# Altium schematic sheet 100-677-01-00 BCB.SchDoc: Battery Control Board (part 3 of 3)
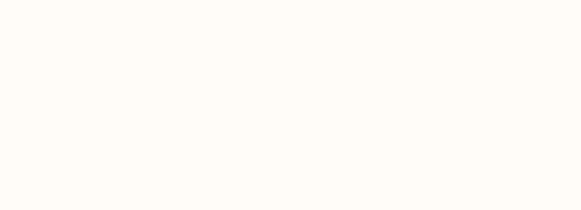
[diagram p7: 100-677-01-00 BCB.SchDoc, bottom right]

## Library data of the parts (continued)
R88 = Res 10M 1206: RES 10.0M OHM 1/4W 1% 1206 SMD; Manufacturer 1: Vishay Dale; Manufacturer Part Number 1: CRCW120610M0FKEA; Power (Watts): 0.25W, 1/4W; Temperature Coefficient: ±100ppm/°C; Category 1: Resistors; Supplier 1: Digi-Key; Supplier Part Number 1: 541-10.0MFTR-ND; Stock 1: 40000; Pricing 1: 5000=0.0102, 10000=0.00918, 25000=0.00816, 50000=0.0068, 100000=0.00564, 250000=0.0051, 500000=0.00459 (USD); Resistance (Ohms): 10M; Composition: Thick Film; Features: Automotive AEC-Q200 Qualified; Tolerance: ±1%; Package / Case: 1206 (3216 Metric); Supplier Device Package: 1206 (3216 Metric); Size / Dimension: 0.126" L x 0.063" W (3.20mm x 1.60mm); Height: 0.024" (0.60mm); Number of Terminations: 2; Packaging: Tape & Reel (TR); ComponentLink1URL: http://www.vishay.com/doc?20035; ComponentLink1Description: http://www.vishay.com/doc?20035; RoHS 1: RoHS Compliant; Description 1: RES 10.0M OHM 1/4W 1% 1206 SMD
R92 R93 = Res 2.2M 1206: RES 2.2M OHM 1/4W 5% 1206 SMD; Manufacturer 1: Yageo; Manufacturer Part Number 1: RC1206JR-072M2L; Power (Watts): 0.25W, 1/4W; Temperature Coefficient: ±100ppm/°C; Category 1: Resistors; Supplier 1: Digi-Key; Supplier Part Number 1: 311-2.2MERTR-ND; Stock 1: 65000; Pricing 1: 5000=0.00283, 10000=0.00246, 25000=0.00216, 50000=0.00198, 125000=0.00194 (USD); Resistance (Ohms): 2.2M; Composition: Thick Film; Features: -; Tolerance: ±5%; Package / Case: 1206 (3216 Metric); Supplier Device Package: 1206; Size / Dimension: 0.122" L x 0.063" W (3.10mm x 1.60mm); Height: 0.026" (0.65mm); Number of Terminations: 2; Packaging: Tape & Reel (TR); ComponentLink1URL: http://www.yageo.com/documents/recent/PYu-RC1206_51_RoHS_L-4.pdf; ComponentLink1Description: http://www.yageo.com/documents/recent/PYu-RC1206_51_RoHS_L-4.pdf; RoHS 1: RoHS Compliant; Description 1: RES 2.2M OHM 1/4W 5% 1206 SMD
R100 = Res 100K 0603: RES 100K OHM 1/10W 1% 0603 SMD; Manufacturer 1: Panasonic Electronic Components; Manufacturer Part Number 1: ERJ-3EKF1003V; Power (Watts): 0.1W, 1/10W; Temperature Coefficient: ±100ppm/°C; Category 1: Resistors; Supplier 1: Digi-Key; Supplier Part Number 1: P100KHCT-ND; Stock 1: 12685703; Pricing 1: 1=0.1, 50=0.0138, 100=0.0105, 250=0.0078, 500=0.00576, 1000=0.00384 (USD); Resistance (Ohms): 100k; Composition: Thick Film; Features: -; Tolerance: ±1%; Package / Case: 0603 (1608 Metric); Supplier Device Package: 0603; Size / Dimension: 0.063" L x 0.031" W (1.60mm x 0.80mm); Height: 0.022" (0.55mm); Number of Terminations: 2; Packaging: Cut Tape (CT); ComponentLink1URL: http://industrial.panasonic.com/www-cgi/jvcr13pz.cgi?E+PZ+3+AOA0002+ERJ3EKF1003V+7+WW; ComponentLink1Description: http://industrial.panasonic.com/www-cgi/jvcr13pz.cgi?E+PZ+3+AOA0002+ERJ3EKF1003V+7+WW; RoHS 1: RoHS Compliant; Description 1: RES 100K OHM 1/10W 1% 0603 SMD
R101 = Res 270 0603: RES 270 OHM 1/10W 5% 0603 SMD; Manufacturer 1: Panasonic Electronic Components; Manufacturer Part Number 1: ERJ-3GEYJ271V; Power (Watts): 0.1W, 1/10W; Temperature Coefficient: ±200ppm/°C; Category 1: Resistors; Supplier 1: Digi-Key; Supplier Part Number 1: P270GTR-ND; Stock 1: 205000; Pricing 1: 5000=0.00152, 10000=0.00132, 25000=0.00116, 50000=0.00106, 125000=0.00104 (USD); Resistance (Ohms): 270; Composition: Thick Film; Features: -; Tolerance: ±5%; Package / Case: 0603 (1608 Metric); Supplier Device Package: 0603; Size / Dimension: 0.063" L x 0.031" W (1.60mm x 0.80mm); Height: 0.022" (0.55mm); Number of Terminations: 2; Packaging: Tape & Reel (TR); ComponentLink1URL: http://industrial.panasonic.com/www-cgi/jvcr13pz.cgi?E+PZ+3+AOA0001+ERJ3GEYJ271V+7+WW; ComponentLink1Description: http://industrial.panasonic.com/www-cgi/jvcr13pz.cgi?E+PZ+3+AOA0001+ERJ3GEYJ271V+7+WW; RoHS 1: RoHS Compliant; Description 1: RES 270 OHM 1/10W 5% 0603 SMD
R102 = Res 150K 0603: RES 150K OHM 1/10W 1% 0603 SMD; Manufacturer 1: Yageo; Manufacturer Part Number: RC0603FR-07150KL; Power (Watts): 0.1W, 1/10W; Temperature Coefficient: ±100ppm/°C; Category 1: Resistors; Supplier 1: Digi-Key; Supplier Part Number 1: 311-150KHRDKR-ND; Stock 1: 109324; Pricing 1: 1=0.1, 10=0.014, 25=0.0104, 100=0.0063, 250=0.0054, 500=0.00382, 1000=0.0027, 2500=0.00234 (USD); Resistance (Ohms): 150k; Composition: Thick Film; Features: -; Tolerance: ±1%; Package / Case: 0603 (1608 Metric); Supplier Device Package: 0603; Size / Dimension: 0.063" L x 0.031" W (1.60mm x 0.80mm); Height: 0.022" (0.55mm); Number of Terminations: 2; Packaging: Digi-Reel?; ComponentLink1URL: http://www.yageo.com/documents/recent/PYu-RC0603_51_RoHS_L_4.pdf; ComponentLink1Description: http://www.yageo.com/documents/recent/PYu-RC0603_51_RoHS_L_4.pdf; RoHS 1: RoHS Compliant; Description 1: RES 150K OHM 1/10W 1% 0603 SMD
R109 R114 = Res 300 0603: RES 300 OHM 1/10W 5% 0603 SMD; Manufacturer 1: Panasonic Electronic Components; Manufacturer Part Number 1: ERJ-3GEYJ301V; Power (Watts): 0.1W, 1/10W; Temperature Coefficient: ±200ppm/°C; Category 1: Resistors; Supplier 1: Digi-Key; Supplier Part Number 1: P300GTR-ND; Stock 1: 315000; Pricing 1: 5000=0.00152, 10000=0.00132, 25000=0.00116, 50000=0.00106, 125000=0.00104 (USD); Resistance (Ohms): 300; Composition: Thick Film; Features: -; Tolerance: ±5%; Package / Case: 0603 (1608 Metric); Supplier Device Package: 0603; Size / Dimension: 0.063" L x 0.031" W (1.60mm x 0.80mm); Height: 0.022" (0.55mm); Number of Terminations: 2; Packaging: Tape & Reel (TR); ComponentLink1URL: http://industrial.panasonic.com/www-cgi/jvcr13pz.cgi?E+PZ+3+AOA0001+ERJ3GEYJ301V+7+WW; ComponentLink1Description: http://industrial.panasonic.com/www-cgi/jvcr13pz.cgi?E+PZ+3+AOA0001+ERJ3GEYJ301V+7+WW; RoHS 1: RoHS Compliant; Description 1: RES 300 OHM 1/10W 5% 0603 SMD
R115 R116 = Res 100 0805: RES 100 OHM 1/8W 5% 0805 SMD; Manufacturer 1: Panasonic Electronic Components; Manufacturer Part Number 1: ERJ-6GEYJ101V; Category 1: Resistors; Power (Watts): 0.125W, 1/8W; Temperature Coefficient: ±200ppm/°C; Supplier 1: Digi-Key; Supplier Part Number 1: P100ATR-ND; RoHS 1: RoHS Compliant; Description 1: RES 100 OHM 1/8W 5% 0805 SMD; Stock 1: 1305000; Pricing 1: 5000=0.00266, 10000=0.00231, 25000=0.00203, 50000=0.00186, 125000=0.00182 (USD); Resistance (Ohms): 100; Composition: Thick Film; Features: -; Tolerance: ±5%; Package / Case: 0805 (2012 Metric); Supplier Device Package: 0805; Size / Dimension: 0.079" L x 0.049" W (2.00mm x 1.25mm); Height: 0.028" (0.70mm); Number of Terminations: 2; Packaging: Tape & Reel (TR); ComponentLink1URL: http://industrial.panasonic.com/www-cgi/jvcr13pz.cgi?E+PZ+3+AOA0001+ERJ6GEYJ101V+7+WW; ComponentLink1Description: http://industrial.panasonic.com/www-cgi/jvcr13pz.cgi?E+PZ+3+AOA0001+ERJ6GEYJ101V+7+WW
R117 R118 = Res 20K 0603: RES 20.0K OHM 1/10W 1% 0603 SMD; Manufacturer 1: Yageo; Manufacturer Part Number 1: RC0603FR-0720KL; Category 1: Resistors; Power (Watts): 0.1W, 1/10W; Temperature Coefficient: ±100ppm/°C; Supplier 1: Digi-Key; Supplier Part Number 1: 311-20.0KHRTR-ND; RoHS 1: RoHS Compliant; Description 1: RES 20.0K OHM 1/10W 1% 0603 SMD; Stock 1: 1015000; Pricing 1: 5000=0.00171, 10000=0.00149, 25000=0.00131, 50000=0.0012, 125000=0.00117 (USD); Resistance (Ohms): 20k; Composition: Thick Film; Features: -; Tolerance: ±1%; Package / Case: 0603 (1608 Metric); Supplier Device Package: 0603; Size / Dimension: 0.063" L x 0.031" W (1.60mm x 0.80mm); Height: 0.022" (0.55mm); Number of Terminations: 2; Packaging: Tape & Reel (TR); ComponentLink1URL: http://www.yageo.com/documents/recent/PYu-RC0603_51_RoHS_L_4.pdf; ComponentLink1Description: http://www.yageo.com/documents/recent/PYu-RC0603_51_RoHS_L_4.pdf
R121 R122 = Res 100 0603: RES 100 OHM 1/10W 5% 0603 SMD; Manufacturer 1: Panasonic Electronic Components; Manufacturer Part Number 1: ERJ-3GEYJ101V; Category 1: Resistors; Power (Watts): 0.1W, 1/10W; Temperature Coefficient: ±200ppm/°C; Supplier 1: Digi-Key; Supplier Part Number 1: P100GCT-ND; RoHS 1: RoHS Compliant; Description 1: RES 100 OHM 1/10W 5% 0603 SMD; Stock 1: 1931036; Pricing 1: 1=0.1, 50=0.0092, 100=0.007, 250=0.0052, 500=0.00384, 1000=0.00256 (USD); Resistance (Ohms): 100; Composition: Thick Film; Features: -; Tolerance: ±5%; Package / Case: 0603 (1608 Metric); Supplier Device Package: 0603; Size / Dimension: 0.063" L x 0.031" W (1.60mm x 0.80mm); Height: 0.022" (0.55mm); Number of Terminations: 2; Packaging: Cut Tape (CT); ComponentLink1URL: http://industrial.panasonic.com/www-cgi/jvcr13pz.cgi?E+PZ+3+AOA0001+ERJ3GEYJ101V+7+WW; ComponentLink1Description: http://industrial.panasonic.com/www-cgi/jvcr13pz.cgi?E+PZ+3+AOA0001+ERJ3GEYJ101V+7+WW
R123 R152 = Res 100K 0603: RES 100K OHM 1/10W 1% 0603 SMD; Manufacturer 1: Panasonic Electronic Components; Manufacturer Part Number 1: ERJ-3EKF1003V; Category 1: Resistors; Power (Watts): 0.1W, 1/10W; Temperature Coefficient: ±100ppm/°C; Supplier 1: Digi-Key; Supplier Part Number 1: P100KHCT-ND; RoHS 1: RoHS Compliant; Description 1: RES 100K OHM 1/10W 1% 0603 SMD; Stock 1: 12685703; Pricing 1: 1=0.1, 50=0.0138, 100=0.0105, 250=0.0078, 500=0.00576, 1000=0.00384 (USD); Resistance (Ohms): 100k; Composition: Thick Film; Features: -; Tolerance: ±1%; Package / Case: 0603 (1608 Metric); Supplier Device Package: 0603; Size / Dimension: 0.063" L x 0.031" W (1.60mm x 0.80mm); Height: 0.022" (0.55mm); Number of Terminations: 2; Packaging: Cut Tape (CT); ComponentLink1URL: http://industrial.panasonic.com/www-cgi/jvcr13pz.cgi?E+PZ+3+AOA0002+ERJ3EKF1003V+7+WW; ComponentLink1Description: http://industrial.panasonic.com/www-cgi/jvcr13pz.cgi?E+PZ+3+AOA0002+ERJ3EKF1003V+7+WW
R124 R127 = Res 10K 0603: RES 10K OHM 1/10W 5% 0603 SMD; Manufacturer 1: Panasonic Electronic Components; Manufacturer Part Number 1: ERJ-3GEYJ103V; Category 1: Resistors; Power (Watts): 0.1W, 1/10W; Temperature Coefficient: ±200ppm/°C; Supplier 1: Digi-Key; Supplier Part Number 1: P10KGCT-ND; RoHS 1: RoHS Compliant; Description 1: RES 10K OHM 1/10W 5% 0603 SMD; Stock 1: 16356863; Pricing 1: 1=0.1, 50=0.0092, 100=0.007, 250=0.0052, 500=0.00384, 1000=0.00256 (USD); Resistance (Ohms): 10k; Composition: Thick Film; Features: -; Tolerance: ±5%; Package / Case: 0603 (1608 Metric); Supplier Device Package: 0603; Size / Dimension: 0.063" L x 0.031" W (1.60mm x 0.80mm); Height: 0.022" (0.55mm); Number of Terminations: 2; Packaging: Cut Tape (CT); ComponentLink1URL: http://industrial.panasonic.com/www-cgi/jvcr13pz.cgi?E+PZ+3+AOA0001+ERJ3GEYJ103V+7+WW; ComponentLink1Description: http://industrial.panasonic.com/www-cgi/jvcr13pz.cgi?E+PZ+3+AOA0001+ERJ3GEYJ103V+7+WW
R125 R129 = Res 1K 0603: RES 1.00K OHM 1/10W 1% 0603 SMD; Manufacturer 1: Yageo; Manufacturer Part Number: RC0603FR-071KL; Category 1: Resistors; Power (Watts): 0.1W, 1/10W; Temperature Coefficient: ±100ppm/°C; Supplier 1: Digi-Key; Supplier Part Number 1: 311-1.00KHRTR-ND; RoHS 1: RoHS Compliant; Description 1: RES 1.00K OHM 1/10W 1% 0603 SMD; Stock 1: 4960000; Pricing 1: 5000=0.00171, 10000=0.00149, 25000=0.00131, 50000=0.0012, 125000=0.00117 (USD); Resistance (Ohms): 1k; Composition: Thick Film; Features: -; Tolerance: ±1%; Package / Case: 0603 (1608 Metric); Supplier Device Package: 0603; Size / Dimension: 0.063" L x 0.031" W (1.60mm x 0.80mm); Height: 0.022" (0.55mm); Number of Terminations: 2; Packaging: Tape & Reel (TR); ComponentLink1URL: http://www.yageo.com/documents/recent/PYu-RC0603_51_RoHS_L_4.pdf; ComponentLink1Description: http://www.yageo.com/documents/recent/PYu-RC0603_51_RoHS_L_4.pdf
R128 = Res 8.2 1206: RES 8.2 OHM 1/4W 5% 1206 SMD; Manufacturer 1: Panasonic Electronic Components; Manufacturer Part Number 1: ERJ-8GEYJ8R2V; Category 1: Resistors; Power (Watts): 0.25W, 1/4W; Temperature Coefficient: -100/ +600ppm/°C; Supplier 1: Digi-Key; Supplier Part Number 1: P8.2ETR-ND; RoHS 1: RoHS Compliant; Description 1: RES 8.2 OHM 1/4W 5% 1206 SMD; Stock 1: 50000; Pricing 1: 5000=0.00399, 10000=0.00347, 25000=0.00305, 50000=0.00279, 125000=0.00274 (USD); Resistance (Ohms): 8.2; Composition: Thick Film; Features: -; Tolerance: ±5%; Package / Case: 1206 (3216 Metric); Supplier Device Package: 1206; Size / Dimension: 0.126" L x 0.063" W (3.20mm x 1.60mm); Height: 0.028" (0.70mm); Number of Terminations: 2; Packaging: Tape & Reel (TR); ComponentLink1URL: http://industrial.panasonic.com/www-cgi/jvcr13pz.cgi?E+PZ+3+AOA0001+ERJ8GEYJ8R2V+7+WW; ComponentLink1Description: http://industrial.panasonic.com/www-cgi/jvcr13pz.cgi?E+PZ+3+AOA0001+ERJ8GEYJ8R2V+7+WW
R130 R131 = Res 1M 0603 5%: RES 1.0M OHM 1/10W 5% 0603 SMD; Manufacturer 1: Yageo; Manufacturer Part Number 1: RC0603JR-071ML; Category 1: Resistors; Power (Watts): 0.1W, 1/10W; Temperature Coefficient: ±100ppm/°C; Supplier 1: Digi-Key; Supplier Part Number 1: 311-1.0MGRTR-ND; RoHS 1: RoHS Compliant; Description 1: RES 1.0M OHM 1/10W 5% 0603 SMD; Stock 1: 1645000; Pricing 1: 5000=0.00131, 10000=0.00114, 25000=0.001, 50000=0.00092, 125000=0.0009 (USD); Resistance (Ohms): 1M; Composition: Thick Film; Features: -; Tolerance: ±5%; Package / Case: 0603 (1608 Metric); Supplier Device Package: 0603; Size / Dimension: 0.063" L x 0.031" W (1.60mm x 0.80mm); Height: 0.022" (0.55mm); Number of Terminations: 2; Packaging: Tape & Reel (TR); ComponentLink1URL: http://www.yageo.com/documents/recent/PYu-RC0603_51_RoHS_L_4.pdf; ComponentLink1Description: http://www.yageo.com/documents/recent/PYu-RC0603_51_RoHS_L_4.pdf
R133 = Res NP 0805: Do not Populate
R134 = Res 0 0805: RES 0.0 OHM 1/10W 0603 SMD; Manufacturer 1: Panasonic Electronic Components; Manufacturer Part Number: ERJ-3GEY0R00V; Category 1: Resistors; Resistance (Ohms): 0.0; Power (Watts): 0.1W, 1/10W; Tolerance: Jumper; Supplier 1: Digi-Key; Supplier Part Number 1: P0.0GTR-ND; RoHS 1: RoHS Compliant; Description 1: RES 0.0 OHM 1/10W 0603 SMD; Stock 1: 15740000; Pricing 1: 5000=0.00152, 10000=0.00132, 25000=0.00116 (USD); Composition: Thick Film; Features: -; Temperature Coefficient: -; Package / Case: 0603 (1608 Metric); Supplier Device Package: 0603; Size / Dimension: 0.063" L x 0.031" W (1.60mm x 0.80mm); Height: 0.022" (0.55mm); Number of Terminations: 2; Packaging: Tape & Reel (TR); ComponentLink1URL: http://industrial.panasonic.com/www-cgi/jvcr13pz.cgi?E+PZ+3+AOA0001+ERJ3GEY0R00V+7+WW; ComponentLink1Description: http://industrial.panasonic.com/www-cgi/jvcr13pz.cgi?E+PZ+3+AOA0001+ERJ3GEY0R00V+7+WW
R135 = Res 200K 0603: RES 200K OHM 1/10W 1% 0603 SMD; Manufacturer 1: Yageo; Manufacturer Part Number 1: RC0603FR-07200KL; Category 1: Resistors; Power (Watts): 0.1W, 1/10W; Temperature Coefficient: ±100ppm/°C; Supplier 1: Digi-Key; Supplier Part Number 1: 311-200KHRTR-ND; RoHS 1: RoHS Compliant; Description 1: RES 200K OHM 1/10W 1% 0603 SMD; Stock 1: 205000; Pricing 1: 5000=0.00171, 10000=0.00149, 25000=0.00131, 50000=0.0012, 125000=0.00117 (USD); Resistance (Ohms): 200k; Composition: Thick Film; Features: -; Tolerance: ±1%; Package / Case: 0603 (1608 Metric); Supplier Device Package: 0603; Size / Dimension: 0.063" L x 0.031" W (1.60mm x 0.80mm); Height: 0.022" (0.55mm); Number of Terminations: 2; Packaging: Tape & Reel (TR); ComponentLink1URL: http://www.yageo.com/documents/recent/PYu-RC0603_51_RoHS_L_4.pdf; ComponentLink1Description: http://www.yageo.com/documents/recent/PYu-RC0603_51_RoHS_L_4.pdf
R136-R139 = Res 2M 0603: RES 2.0M OHM 1/10W 5% 0603 SMD; Manufacturer 1: Panasonic Electronic Components; Manufacturer Part Number 1: ERJ-3GEYJ205V; Category 1: Resistors; Power (Watts): 0.1W, 1/10W; Temperature Coefficient: -400/ +150ppm/°C; Supplier 1: Digi-Key; Supplier Part Number 1: P2.0MGTR-ND; RoHS 1: RoHS Compliant; Description 1: RES 2.0M OHM 1/10W 5% 0603 SMD; Stock 1: 200000; Pricing 1: 5000=0.00152, 10000=0.00132, 25000=0.00116, 50000=0.00106, 125000=0.00104 (USD); Resistance (Ohms): 2M; Composition: Thick Film; Features: -; Tolerance: ±5%; Package / Case: 0603 (1608 Metric); Supplier Device Package: 0603; Size / Dimension: 0.063" L x 0.031" W (1.60mm x 0.80mm); Height: 0.022" (0.55mm); Number of Terminations: 2; Packaging: Tape & Reel (TR); ComponentLink1URL: http://industrial.panasonic.com/www-cgi/jvcr13pz.cgi?E+PZ+3+AOA0001+ERJ3GEYJ205V+7+WW; ComponentLink1Description: http://industrial.panasonic.com/www-cgi/jvcr13pz.cgi?E+PZ+3+AOA0001+ERJ3GEYJ205V+7+WW
R140 R141 = Res 510K 0603: RES 510K OHM 1/10W 5% 0603 SMD; Manufacturer 1: Vishay Dale; Manufacturer Part Number 1: CRCW0603510KJNEA; Category 1: Resistors; Power (Watts): 0.1W, 1/10W; Temperature Coefficient: ±200ppm/°C; Supplier 1: Digi-Key; Supplier Part Number 1: 541-510KGCT-ND; RoHS 1: RoHS Compliant; Description 1: RES 510K OHM 1/10W 5% 0603 SMD; Stock 1: 28973; Pricing 1: 10=0.074, 50=0.04, 200=0.02295, 1000=0.01566 (USD); Resistance (Ohms): 510k; Composition: Thick Film; Features: Automotive AEC-Q200 Qualified; Tolerance: ±5%; Package / Case: 0603 (1608 Metric); Supplier Device Package: 0603 (1608 Metric); Size / Dimension: 0.061" L x 0.033" W (1.55mm x 0.85mm); Height: 0.020" (0.50mm); Number of Terminations: 2; Packaging: Cut Tape (CT); ComponentLink1URL: http://www.vishay.com/doc?20035; ComponentLink1Description: http://www.vishay.com/doc?20035
R142-R144 = Res 3M 0603: RES 3M OHM 1/10W 5% 0603 SMD; Manufacturer 1: Panasonic Electronic Components; Manufacturer Part Number 1: ERJ-3GEYJ305V; Category 1: Resistors; Power (Watts): 0.1W, 1/10W; Temperature Coefficient: -400/ +150ppm/°C; Supplier 1: Digi-Key; Supplier Part Number 1: P3.0MGTR-ND; RoHS 1: RoHS Compliant; Description 1: RES 3M OHM 1/10W 5% 0603 SMD; Stock 1: 230000; Pricing 1: 5000=0.00152, 10000=0.00132, 25000=0.00116, 50000=0.00106, 125000=0.00104 (USD); Resistance (Ohms): 3M; Composition: Thick Film; Features: -; Tolerance: ±5%; Package / Case: 0603 (1608 Metric); Supplier Device Package: 0603; Size / Dimension: 0.063" L x 0.031" W (1.60mm x 0.80mm); Height: 0.022" (0.55mm); Number of Terminations: 2; Packaging: Tape & Reel (TR); ComponentLink1URL: http://industrial.panasonic.com/www-cgi/jvcr13pz.cgi?E+PZ+3+AOA0001+ERJ3GEYJ305V+7+WW; ComponentLink1Description: http://industrial.panasonic.com/www-cgi/jvcr13pz.cgi?E+PZ+3+AOA0001+ERJ3GEYJ305V+7+WW
R145-R147 = Res 18K 2512: RES 18K OHM 1W 5% 2512 SMD; Manufacturer 1: Panasonic Electronic Components; Manufacturer Part Number 1: ERJ-1TYJ183U; Category 1: Resistors; Temperature Coefficient: ±200ppm/°C; Supplier 1: Digi-Key; Supplier Part Number 1: PT18KXTR-ND; RoHS 1: RoHS Compliant; Description 1: RES 18K OHM 1W 5% 2512 SMD; Stock 1: 28000; Pricing 1: 4000=0.0861, 8000=0.07749, 12000=0.07577, 28000=0.07319, 100000=0.07106 (USD); Resistance (Ohms): 18k; Power (Watts): 1W; Composition: Thick Film; Features: -; Tolerance: ±5%; Package / Case: 2512 (6432 Metric); Supplier Device Package: 2512; Size / Dimension: 0.252" L x 0.126" W (6.40mm x 3.20mm); Height: 0.028" (0.70mm); Number of Terminations: 2; Packaging: Tape & Reel (TR); ComponentLink1URL: http://industrial.panasonic.com/www-cgi/jvcr13pz.cgi?E+PZ+3+AOA0001+ERJ1TYJ183U+7+WW; ComponentLink1Description: http://industrial.panasonic.com/www-cgi/jvcr13pz.cgi?E+PZ+3+AOA0001+ERJ1TYJ183U+7+WW
R148-R151 = Res 0.008 2512: RES .008 OHM 1W 1% 2512 SMD; Manufacturer 1: Vishay Dale; Manufacturer Part Number: WSL25128L000FEA; Category 1: Resistors; Temperature Coefficient: ±75ppm/°C; Supplier 1: Digi-Key; Supplier Part Number 1: WSLG-.008TR-ND; RoHS 1: RoHS Compliant; Description 1: RES .008 OHM 1W 1% 2512 SMD; Stock 1: 0; Pricing 1: 2000=0.481, 6000=0.47175, 10000=0.46065, 50000=0.444 (USD); Resistance (Ohms): 0.008; Power (Watts): 1W; Composition: Metal Element; Features: Current Sense; Tolerance: ±1%; Package / Case: 2512 (6432 Metric); Supplier Device Package: 2512; Size / Dimension: 0.250" L x 0.125" W (6.35mm x 3.18mm); Height: 0.035" (0.89mm); Number of Terminations: 2; Packaging: Tape & Reel (TR); ComponentLink1URL: http://www.vishay.com/docs/30100/wsl.pdf; ComponentLink1Description: http://www.vishay.com/docs/30100/wsl.pdf
TP100 = Test Point SMT: TEST POINT, SMT; Manufacturer: Keystone Electronics; Manufacturer Part Number: 5016; Supplier 1: Digi-Key; Supplier Part Number 1: 5016KCT-ND; RoHS: RoHS Compliant; Category: Test and Measurement; Stock 1: 262220; Pricing 1: 1=0.41, 10=0.384, 50=0.2796, 100=0.2686, 250=0.24124, 500=0.23026 (USD); Type: PC Test Point, Compact; Terminal: 0.015" (0.38mm) Phosphor Bronze, Silver Plate; Mounting Type: Surface Mount; Material: Phosphor Bronze; Color: -; Packaging: Cut Tape (CT); ComponentLink1URL: http://mail.keyelco.com/ENG._DEPT/PDF%20CAT%20NO%20Drawings/5016.pdf; ComponentLink1Description: http://mail.keyelco.com/ENG._DEPT/PDF%20CAT%20NO%20Drawings/5016.pdf
TR100 TR101 = Thermister 10K: Thick Film Resistors - SMD 18K OHM 5%; Manufacturer 1: Yageo; Manufacturer Part Number 1: RC2512JK-0718KL; Power Rating: 1 W; Resistance: 18 kOhms; Temperature Coefficient: 100 PPM / C; Tolerance: 10 %; Voltage Rating: 200 V; Supplier 1: Mouser; Supplier Part Number 1: 603-RC2512JK-0718KL; RoHS 1: RoHS Compliant; Description 1: Thick Film Resistors - SMD 18K OHM 5%; Category 1: Thick Film Resistors - SMD; Stock 1: 0; Pricing 1: 4000=0.155, 8000=0.138, 12000=0.103, 28000=0.086, 52000=0.078, 100000=0.069 (AUD); Dimensions: 3.1 mm W x 6.35 mm L x 0.55 mm H; Operating Temperature Range: - 55 C to + 155 C; Package / Case: 2512 (6432 metric); Packaging: Reel; Product: Thick Film Resistors General Purpose; Series: RC; Termination Style: SMD/SMT; Case Code - in: 2512; Case Code - mm: 6432; Product Category: .; RoHS - Mouser: Y; Minimum Order Quantity: 4000; Reeling: True; ComponentLink1URL: http://www.yageo.com/documents/recent/PYu-RC2512_51_RoHS_L_(4).pdf; ComponentLink1Description: http://www.yageo.com/documents/recent/PYu-RC2512_51_RoHS_L_(4).pdf
U1 U3 U5 U7 = Battery Protection R5432: IC, BATTERY PROT, LI+, SSOP-24; Manufacturer: Ricoh; Manufacturers Part Number: R5432V
U2 = Comparator LM2901M: IC COMPARATOR QUAD LOW POWER 14-SOP; Manufacturer: Texas Instruments; Manufacturer Part Number: LP2901DR; Number of Elements: 4; Output Type: CMOS, MOS, Open-Collector; Voltage - Supply, Single/Dual (?: 3 V ~ 30 V; Voltage - Input Offset (Max): 5mV @ 30V; Current - Input Bias (Max): 0.025µA @ 5V; Current - Output (Typ): 30mA @ 5V; Current - Quiescent (Max): 100µA; Supplier 1: Digi-Key; Supplier Part Number 1: 296-26119-6-ND; RoHS: RoHS Compliant; Category: Integrated Circuits (ICs); Stock 1: 7104; Pricing 1: 1=0.68, 10=0.596, 25=0.5264, 100=0.4587, 250=0.39932, 500=0.3399, 1000=0.27225 (USD); Type: General Purpose; CMRR, PSRR (Typ): -; Propagation Delay (Max): -; Hysteresis: -; Operating Temperature: -40°C ~ 85°C; Package / Case: 14-SOIC (0.154", 3.90mm Width); Mounting Type: Surface Mount; Packaging: Digi-Reel畮ISHIDDEN=T; ComponentLink1URL: http://www.ti.com/lit/ds/symlink/lp2901.pdf; ComponentLink1Description: http://www.ti.com/lit/ds/symlink/lp2901.pdf
U4 = Optocoupler 4N25: OPTOCOUPLER TRANS-OUT 6-SMD; Manufacturer: Fairchild Semiconductor; Manufacturer Part Number: 4N25SR2M; Number of Channels: 1; Input Type: DC; Voltage - Isolation: 7500Vpk; Current Transfer Ratio (Min): 20% @ 10mA; Voltage - Output: 30V; Current - DC Forward (If): 60mA; Vce Saturation (Max): 500mV; Output Type: Transistor with Base; Supplier 1: Digi-Key; Supplier Part Number 1: 4N25SR2MCT-ND; RoHS: RoHS Compliant; Category: Isolators; Stock 1: 5253; Pricing 1: 1=0.68, 10=0.519, 25=0.4348, 100=0.3745, 250=0.3322, 500=0.28388 (USD); Current Transfer Ratio (Max): -; Current - Output / Channel: -; Mounting Type: Surface Mount; Package / Case: 6-SMD; Packaging: Cut Tape (CT); ComponentLink1URL: http://www.fairchildsemi.com/ds/4N/4N25M.pdf; ComponentLink1Description: http://www.fairchildsemi.com/ds/4N/4N25M.pdf
U6 = BQ34Z100: IC BATT MGMT LIION/LPO4 14TSSOP; Manufacturer: Texas Instruments; Manufacturer Part Number: BQ34Z100PW; Function: Fuel, Gas Gauge/Monitor; Battery Chemistry: Lithium-Ion (Li-Ion), Lithium Iron Phosphate (LiFePO4); Voltage - Supply: 2.7 V ~ 4.5 V; Supplier 1: Digi-Key; Supplier Part Number 1: 296-30497-5-ND; RoHS: RoHS Compliant; Category: Integrated Circuits (ICs); Stock 1: 70; Pricing 1: 1=6.43, 10=5.738, 100=3.0983, 250=3.04088, 500=2.9835, 750=2.92612, 1000=2.86875 (USD); Operating Temperature: -40°C ~ 85°C; Mounting Type: Surface Mount; Package / Case: 14-TSSOP (0.173", 4.40mm Width); Supplier Device Package: 14-TSSOP; Packaging: Tube; ComponentLink1URL: http://www.ti.com/lit/ds/symlink/bq34z100.pdf; ComponentLink1Description: http://www.ti.com/lit/ds/symlink/bq34z100.pdf
U100 = Regulator S-812C33BMC-C4NT2G: IC REG LDO 3.3V 50MA SOT23-5; Manufacturer 1: Seiko Instruments; Category 1: Integrated Circuits (ICs); Regulator Topology: Positive Fixed; Voltage - Input: Up to 16V; Voltage - Dropout (Typical): 0.23V @ 10mA; Number of Regulators: 1; Current - Output: 50mA (Min); Supplier 1: Digi-Key; Supplier Part Number 1: S-812C33BMC-C4NT2G-ND; Manufacturer Part Number 1: S-812C33BMC-C4NT2G; RoHS 1: RoHS Compliant; Description 1: IC REG LDO 3.3V 50MA SOT23-5; Stock 1: 0; Pricing 1: 3000=0.31683 (USD); Voltage - Output: 3.3V; Current - Limit (Min): -; Operating Temperature: -40°C ~ 85°C; Mounting Type: Surface Mount; Package / Case: SC-74A, SOT-753; Supplier Device Package: SOT-23-5; Packaging: Tape & Reel (TR); ComponentLink1URL: http://datasheet.sii-ic.com/en/voltage_regulator/S812C_E.pdf; ComponentLink1Description: http://datasheet.sii-ic.com/en/voltage_regulator/S812C_E.pdf
U101 = ADC MAX11603: IC ADC SERIAL 8BIT 8CH 16-QSOP; Manufacturer: Maxim Integrated; Manufacturer Part Number: MAX11603EEE+; Number of Bits: 8; Sampling Rate (Per Second): 188k; Data Interface: I²C, Serial; Number of Converters: 1; Power Dissipation (Max): 1.75mW; Voltage Supply Source: Single Supply; Number of Inputs and Type: 8 Single-Ended, Unipolar; 8 Single-Ended, Bipolar; 4 Differential, Unipolar; 4 Differential, Bipolar; Supplier 1: Digi-Key; Supplier Part Number 1: MAX11603EEE+-ND; RoHS: RoHS Compliant; Category: Integrated Circuits (ICs); Stock 1: 402; Pricing 1: 1=3.64, 25=2.55, 100=1.85, 500=1.632 (USD); Operating Temperature: -40°C ~ 85°C; Mounting Type: Surface Mount; Package / Case: 16-SSOP (0.154", 3.90mm Width); Supplier Device Package: 16-QSOP; Packaging: Tube; ComponentLink1URL: http://datasheets.maximintegrated.com/en/ds/MAX11600-MAX11605.pdf; ComponentLink1Description: http://datasheets.maximintegrated.com/en/ds/MAX11600-MAX11605.pdf
U102 = EEPROM AT24C02C: IC EEPROM 8KBIT 400KHZ SOT23-5; Manufacturer: Atmel; Manufacturer Part Number: AT24C08C-STUM-T; Format - Memory: EEPROMs - Serial; Memory Size: 8K (1K x 8); Speed: 400kHz, 1MHz; Interface: I²C, 2-Wire Serial; Voltage - Supply: 1.7 V ~ 5.5 V; Supplier 1: Digi-Key; Supplier Part Number 1: AT24C08C-STUM-TCT-ND; RoHS: RoHS Compliant; Category: Integrated Circuits (ICs); Stock 1: 4750; Pricing 1: 1=0.44, 25=0.3692, 100=0.2973, 1000=0.27265 (USD); Memory Type: EEPROM; Operating Temperature: -40°C ~ 85°C; Package / Case: SC-74A, SOT-753; Supplier Device Package: SOT-23-5; Packaging: Cut Tape (CT); ComponentLink1URL: http://www.atmel.com/Images/doc8787.pdf; ComponentLink1Description: http://www.atmel.com/Images/doc8787.pdf
U103 U104 = Gate DVR IXDD609SIA: IC GATE DVR 9A NON-INV 8-SOIC; Manufacturer: IXYS Integrated Circuits Division; Input Type: Non-Inverting; Configuration: Low-Side; Number of Outputs: 1; Delay Time: 40ns; Voltage - Supply: 4.5 V ~ 35 V; Supplier 1: Digi-Key; Supplier Part Number 1: CLA358-ND; Category: Integrated Circuits (ICs); Supplier: Digi-Key; RoHS: RoHS Compliant; Operating Temperature: -40°C ~ 125°C; Packaging: Tube; Supplier Device Package: 8-SOIC N; Supplier Part Number: CLA358-ND; Current - Peak: 9A; Manufacturer Part Number: IXDD609SIA; Mounting Type: Surface Mount; Number of Configurations: 1; High Side Voltage - Max (Bootstrap): -; Package / Case: 8-SOIC (0.154", 3.90mm Width)